# Altium schematic sheet Digital - STM32.SchDoc
size A4; SheetNumber: 1; SheetTotal: 8
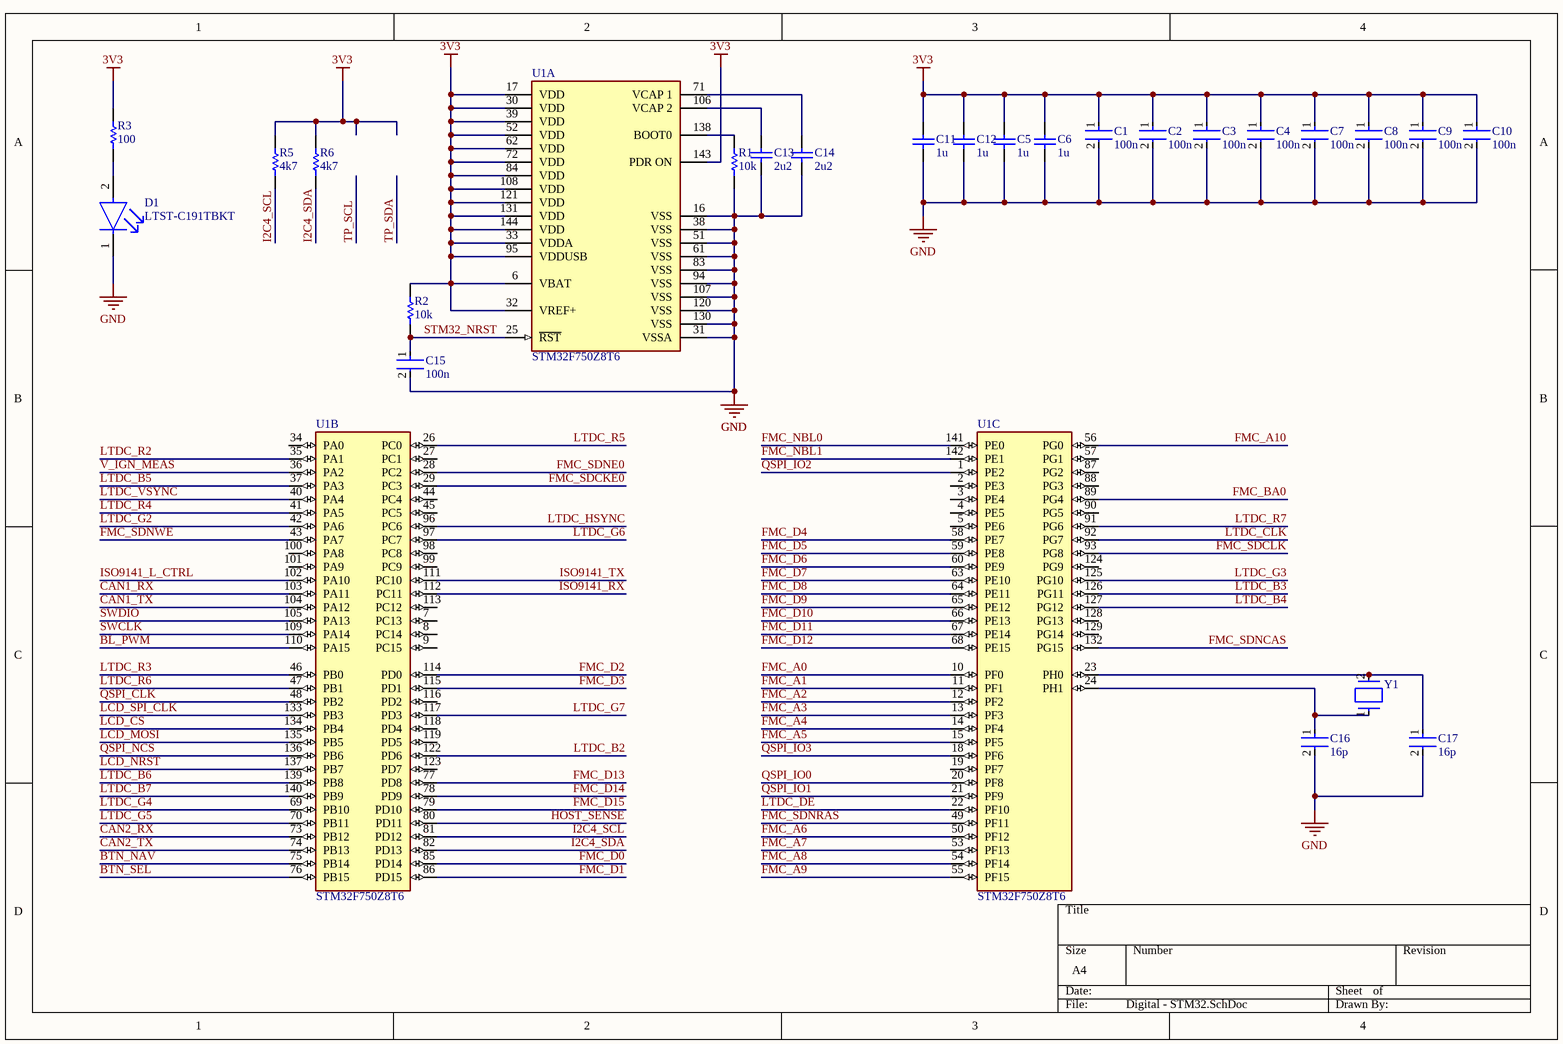
[diagram p0: Digital - STM32.SchDoc]

## Parts
C1  100n  [FP-GRM188-0_1-e0_2_0_55-IPC_A]
C2  100n  [FP-GRM188-0_1-e0_2_0_55-IPC_A]
C3  100n  [FP-GRM188-0_1-e0_2_0_55-IPC_A]
C4  100n  [FP-GRM188-0_1-e0_2_0_55-IPC_A]
C5  1u  [CAPC2013X135X45LL10T25]
C6  1u  [CAPC2013X135X45LL10T25]
C7  100n  [FP-GRM188-0_1-e0_2_0_55-IPC_A]
C8  100n  [FP-GRM188-0_1-e0_2_0_55-IPC_A]
C9  100n  [FP-GRM188-0_1-e0_2_0_55-IPC_A]
C10  100n  [FP-GRM188-0_1-e0_2_0_55-IPC_A]
C11  1u  [CAPC2013X135X45LL10T25]
C12  1u  [CAPC2013X135X45LL10T25]
C13  2u2  [CAPC2013X135X45LL10T25]
C14  2u2  [CAPC2013X135X45LL10T25]
C15  100n  [FP-GRM188-0_1-e0_2_0_55-IPC_A]
C16  16p  [FP-GRM188-0_1-e0_2_0_55-IPC_A]
C17  16p  [FP-GRM188-0_1-e0_2_0_55-IPC_A]
D1  LTST-C191TBKT  [FP-LTST-C191TBKT-MFG]
R1  10k  [RESC1608X55X30ML15T15]
R2  10k  [RESC1608X55X30ML15T15]
R3  100  [RESC1608X55X30ML15T15]
R5  4k7  [RESC1608X55X30ML15T15]
R6  4k7  [RESC1608X55X30ML15T15]
U1  STM32F750Z8T6  [FP-LQFP144-1A-MFG]  (parts A,B,C of 3)
Y1  ABM7-16.000MHZ-D2Y-T  [FP-ABM7-MFG]  (value not drawn)

## Nets
3V3: C1.1 C2.1 C3.1 C4.1 C5.2 C6.2 C7.1 C8.1 C9.1 C10.1 C11.2 C12.2 R2.2 R3.2 R5.2 R6.2 U1.6(VBAT) U1.17(VDD) U1.30(VDD) U1.32(VREF+) U1.33(VDDA) U1.39(VDD) U1.52(VDD) U1.62(VDD) U1.72(VDD) U1.84(VDD) U1.95(VDDUSB) U1.108(VDD) U1.121(VDD) U1.131(VDD) U1.143(PDR_ON) U1.144(VDD)
GND: C1.2 C2.2 C3.2 C4.2 C5.1 C6.1 C7.2 C8.2 C9.2 C10.2 C11.1 C12.1 C13.1 C14.1 C15.2 C16.2 C17.2 D1.1(C) R1.1 U1.16(VSS) U1.31(VSSA) U1.38(VSS) U1.51(VSS) U1.61(VSS) U1.83(VSS) U1.94(VSS) U1.107(VSS) U1.120(VSS) U1.130(VSS)
BL_PWM: U1.110(PA15)
BTN_NAV: U1.75(PB14)
BTN_SEL: U1.76(PB15)
CAN1_RX: U1.103(PA11)
CAN1_TX: U1.104(PA12)
CAN2_RX: U1.73(PB12)
CAN2_TX: U1.74(PB13)
FMC_A0: U1.10(PF0)
FMC_A1: U1.11(PF1)
FMC_A2: U1.12(PF2)
FMC_A3: U1.13(PF3)
FMC_A4: U1.14(PF4)
FMC_A5: U1.15(PF5)
FMC_A6: U1.50(PF12)
FMC_A7: U1.53(PF13)
FMC_A8: U1.54(PF14)
FMC_A9: U1.55(PF15)
FMC_A10: U1.56(PG0)
FMC_BA0: U1.89(PG4)
FMC_D0: U1.85(PD14)
FMC_D1: U1.86(PD15)
FMC_D2: U1.114(PD0)
FMC_D3: U1.115(PD1)
FMC_D4: U1.58(PE7)
FMC_D5: U1.59(PE8)
FMC_D6: U1.60(PE9)
FMC_D7: U1.63(PE10)
FMC_D8: U1.64(PE11)
FMC_D9: U1.65(PE12)
FMC_D10: U1.66(PE13)
FMC_D11: U1.67(PE14)
FMC_D12: U1.68(PE15)
FMC_D13: U1.77(PD8)
FMC_D14: U1.78(PD9)
FMC_D15: U1.79(PD10)
FMC_NBL0: U1.141(PE0)
FMC_NBL1: U1.142(PE1)
FMC_SDCKE0: U1.29(PC3)
FMC_SDCLK: U1.93(PG8)
FMC_SDNCAS: U1.132(PG15)
FMC_SDNE0: U1.28(PC2)
FMC_SDNRAS: U1.49(PF11)
FMC_SDNWE: U1.43(PA7)
HOST_SENSE: U1.80(PD11)
I2C4_SCL: R5.1 U1.81(PD12)
I2C4_SDA: R6.1 U1.82(PD13)
ISO9141_L_CTRL: U1.102(PA10)
ISO9141_RX: U1.112(PC11)
ISO9141_TX: U1.111(PC10)
LCD_CS: U1.134(PB4)
LCD_MOSI: U1.135(PB5)
LCD_NRST: U1.137(PB7)
LCD_SPI_CLK: U1.133(PB3)
LTDC_B2: U1.122(PD6)
LTDC_B3: U1.126(PG11)
LTDC_B4: U1.127(PG12)
LTDC_B5: U1.37(PA3)
LTDC_B6: U1.139(PB8)
LTDC_B7: U1.140(PB9)
LTDC_CLK: U1.92(PG7)
LTDC_DE: U1.22(PF10)
LTDC_G2: U1.42(PA6)
LTDC_G3: U1.125(PG10)
LTDC_G4: U1.69(PB10)
LTDC_G5: U1.70(PB11)
LTDC_G6: U1.97(PC7)
LTDC_G7: U1.117(PD3)
LTDC_HSYNC: U1.96(PC6)
LTDC_R2: U1.35(PA1)
LTDC_R3: U1.46(PB0)
LTDC_R4: U1.41(PA5)
LTDC_R5: U1.26(PC0)
LTDC_R6: U1.47(PB1)
LTDC_R7: U1.91(PG6)
LTDC_VSYNC: U1.40(PA4)
QSPI_CLK: U1.48(PB2)
QSPI_IO0: U1.20(PF8)
QSPI_IO1: U1.21(PF9)
QSPI_IO2: U1.1(PE2)
QSPI_IO3: U1.18(PF6)
QSPI_NCS: U1.136(PB6)
STM32_NRST: C15.1 R2.1 U1.25(~{RST})
SWCLK: U1.109(PA14)
SWDIO: U1.105(PA13)
V_IGN_MEAS: U1.36(PA2)
NetC13_2: C13.2 U1.106(VCAP_2)
NetC14_2: C14.2 U1.71(VCAP_1)
NetC16_1: C16.1 U1.24(PH1) Y1.1
NetC17_1: C17.1 U1.23(PH0) Y1.2
NetD1_2: D1.2(A) R3.1
NetR1_2: R1.2 U1.138(BOOT0)

Not connected (* = marked no-connect by the designer): U1 2(PE3) 3(PE4) 4(PE5) 5(PE6) 7(PC13) 8(PC14) 9(PC15) 19(PF7) 27(PC1) 34(PA0) 44(PC4) 45(PC5) 57(PG1) 87(PG2) 88(PG3) 90(PG5) 98(PC8) 99(PC9) 100(PA8) 101(PA9) 113(PC12) 116(PD2) 118(PD4) 119(PD5) 123(PD7) 124(PG9) 128(PG13) 129(PG14)

## Library data of the parts
C1-C4 C7-C10 C15-C17 = CMP-2006-02792-2: Chip Multilayer Ceramic Capacitors for General Purpose, 0603, 10uF, X5R, 15%, 20%, 6.3V; Packaging: Tape and Reel; Voltage Rating (DC): 6.3V; Width: 0.031inch; Termination: SMD/SMT; Dielectric: X5R; Package Quantity: 4000; Voltage Rating: 6.3V; Capacitance: 10uF; Case/Package: 0603; Min Operating Temperature: -55°C; Voltage: 6.3V; Length: 1.6mm; Thickness: 0.035inch; Lead Free: Lead Free; Depth: 0.8mm; Case Code (Imperial): 0603; Max Operating Temperature: 85°C; Material: Ceramic; Height: 0.8mm; Tolerance: 20%; Mount: Surface Mount; REACH SVHC: No SVHC; Radiation Hardening: No; Case Code (Metric): 1608
C5 C6 C11-C14 = CMP-1662-00015-2: Chip Capacitor, 4.7 uF, +/- 10%, 16 V, -55 to 85 degC, 0805 (2012 Metric), RoHS, Tape and Reel; PartNumber: GRM21BR61C475KA88L; Voltage Rating (DC): 16 V; Capacitance: 4.7 uF; Type (Capacitors): X5R; Case\/Package: 0805; Pins: 2; DatasheetVersion: 03/2016; REACH SVHC: No SVHC; Tolerance: 10%; Width: 1.25 mm; Mount: Surface Mount; ComponentLink1Description: Manufacturer URL; Case Code (Metric): 2012; PackageDescription: 2-Pin Surface Mount Device, Body 2 x 1.25 mm; Height: 1.25 mm; Voltage Rating: 16 V; Max Operating Temperature: 85 degC; RoHSCompliant: true; Length: 2 mm; ComponentLink1URL: http://www.murata.com/; Mounting Technology: Surface Mount; Packaging: Tape and Reel; Min Operating Temperature: -55 degC; ComponentLink2Description: Datasheet; Case Code (Imperial): 0805; Radiation Hardening: No; Package Quantity: 3000; PackageReference: 0805; ComponentLink2URL: http://search.murata.co.jp/Ceramy/image/img/A01X/G101/ENG/GRM21BR61C475KA88-01.pdf
D1 = CMP-22017-000008-1: LED BLUE CLEAR CHIP SMD; Lens Color: Colorless; Dominant Wavelength: 475nm; Forward Current: 20mA; Wavelength: 468nm; Viewing Angle: 130°; Power Dissipation: 76mW; Luminous Intensity: 180mcd; Reverse Voltage: 5V; Number of Elements: 1; Lens Style: Diffused; Forward Voltage: 3.8V; Max Power Dissipation: 75mW; Case Code (Metric): 1608; Packaging: Tape and Reel; Case/Package: 0603; Depth: 1.6mm; Mount: Surface Mount; Lead Free: Lead Free; Min Operating Temperature: -20°C; Lens Transparency: Clear; Illumination Color: Blue; Height: 0.55mm; Test Current: 20mA; Case Code (Imperial): 0603; Max Operating Temperature: 80°C; Number of Pins: 2; Length: 0.8mm; Radiation Hardening: No; Package Quantity: 1; Number of LEDs: 1; Width: 0.8mm; Color: Blue
R1-R3 R5 R6 = CMP-2000-00182-1: Part Number: ERJ-3EKF1003V; Manufacturer: Panasonic
U1 = CMP-12105-000056-1: IC MCU 32BIT 64KB FLASH 144LQFP; Manufacturer: STMicroelectronics; Number Of Cores: 1; Number Of Adc Channels: 24; Number Of Timers/Counters: 15; Number Of A/D Converters: 3; Interface: I2C,SPI,UART,USART,CAN,USB,LIN,IrDA,Ethernet,I2S,Other; Standoff Height: 0.05mm; Ram Size: 320KBytes; Max Supply Voltage: 3.6V; Number Of I2C Channels: 4; Min Supply Voltage: 1.7V; Nominal Supply Current: 12-216mA; Max Junction Temp: +105°C; Data Bus Width: 32bits; Number Of Spi Channels: 6; Core Architecture: ARM Cortex-M7; Number Of Uart Channels: 8; Memory Size: 64KBytes; Frequency: 216MHz; Number Of Pwm Channels: 33; Number Of I/Os: 114; RoHS: TRUE; Temperature Range Low: -40°C; Mouser Description: MCU 32-Bit STM32F750Z8 ARM Cortex M7 RISC 64KB Flash 1.8V/2.5V/3.3V 144-Pin LQFP Tray; Height: 1.6mm; Temperature: -40°C to +105°C; Number Of Usb Channels: 1; Package: LQFP144-1A; Ipc Land Pattern Name: QFP50P2200X2200X160-144; Number Of Ethernet Channels: 1; Automotive: No; Memory Type: FLASH; Digikey Description: IC MCU 32BIT 64KB FLASH 144LQFP; Category: IC; ComponentLink2Description: Datasheet; Device Class L1: Integrated Circuits (ICs); Ambient Temperature Range High: +85°C; Device Class L2: Embedded Processors and Controllers; Device Class L3: Microcontrollers; Temperature Range High: +105°C; Octopart: https://octopart.com/stm32f750z8t6-stmicroelectronics-94048545; Manufacturer Part Number: STM32F750Z8T6; ComponentLink2URL: https://www.st.com/resource/en/datasheet/stm32f750z8.pdf; Ambient Temperature Range Low: -40°C; Lead Free: Yes
Y1 = CMP-27762-000095-1: Crystal 16MHz ±20ppm 18pF SMD-2 6mm x 3.5mm; ESR (Equivalent Series Resistance): 50R; Frequency Stability: 30ppm; Width: 3.3mm; Frequency: 16MHz; Radiation Hardening: No; Height: 0.055inch; Tolerance: 20ppm; Length: 6mm; Case/Package: CSMD; Lead Free: Lead Free; Min Operating Temperature: -40°C; Termination: SMD/SMT; Operating Frequency: 16 MHz; Resistor Type: Ceramic; Packaging: Tape and Reel; Mount: Surface Mount; Load Capacitance: 18pF; Frequency Tolerance: 20ppm; Depth: 3.5mm; Series: ABM7; Package Quantity: 1000; Max Operating Temperature: 85°C; Number of Pins: 2